# Altium project TIDA-010954-RevB.PrjPcb (part 3 of 6)

## Sheet TIDA-010954-Cycloconverter.SchDoc
size 431 x 279 mm; Date: Not shown in title block; ApprovedBy: Not shown in title block; CheckedBy: Not shown in title block; Author: Not shown in title block; CompanyName: Not shown in title block; Engineer: Not shown in title block; Organization: Not shown in title block; Address1: Not shown in title block; Address2: Not shown in title block; Address3: Not shown in title block; Address4: Not shown in title block; DocumentNumber: 2; Revision: Use project parameter SCH_Rev; SheetNumber: 2; SheetTotal: 9; PageSetup: Record=PageOptions|CenterHorizontal=True|CenterVertical=True|PrintScale=1.00|XCorrection=1.00|YCorrection=1.00|PrintKind=0|BorderSize=5000000|LeftOffset=0|BottomOffset=0|Orientation=2|PaperLength=1000|PaperWidth=1000|Scale=100|PaperSource=15|PrintQuality=600|MediaType=1|DitherType=10|PaperKind=Letter|PrintScaleMode=1; CurrentTime: Not shown in title block; CurrentDate: Not shown in title block; Time: Not shown in title block; DocumentFullPathAndName: Not shown in title block; DocumentName: Not shown in title block; ModifiedDate: 1/25/2022; ImagePath: Not shown in title block
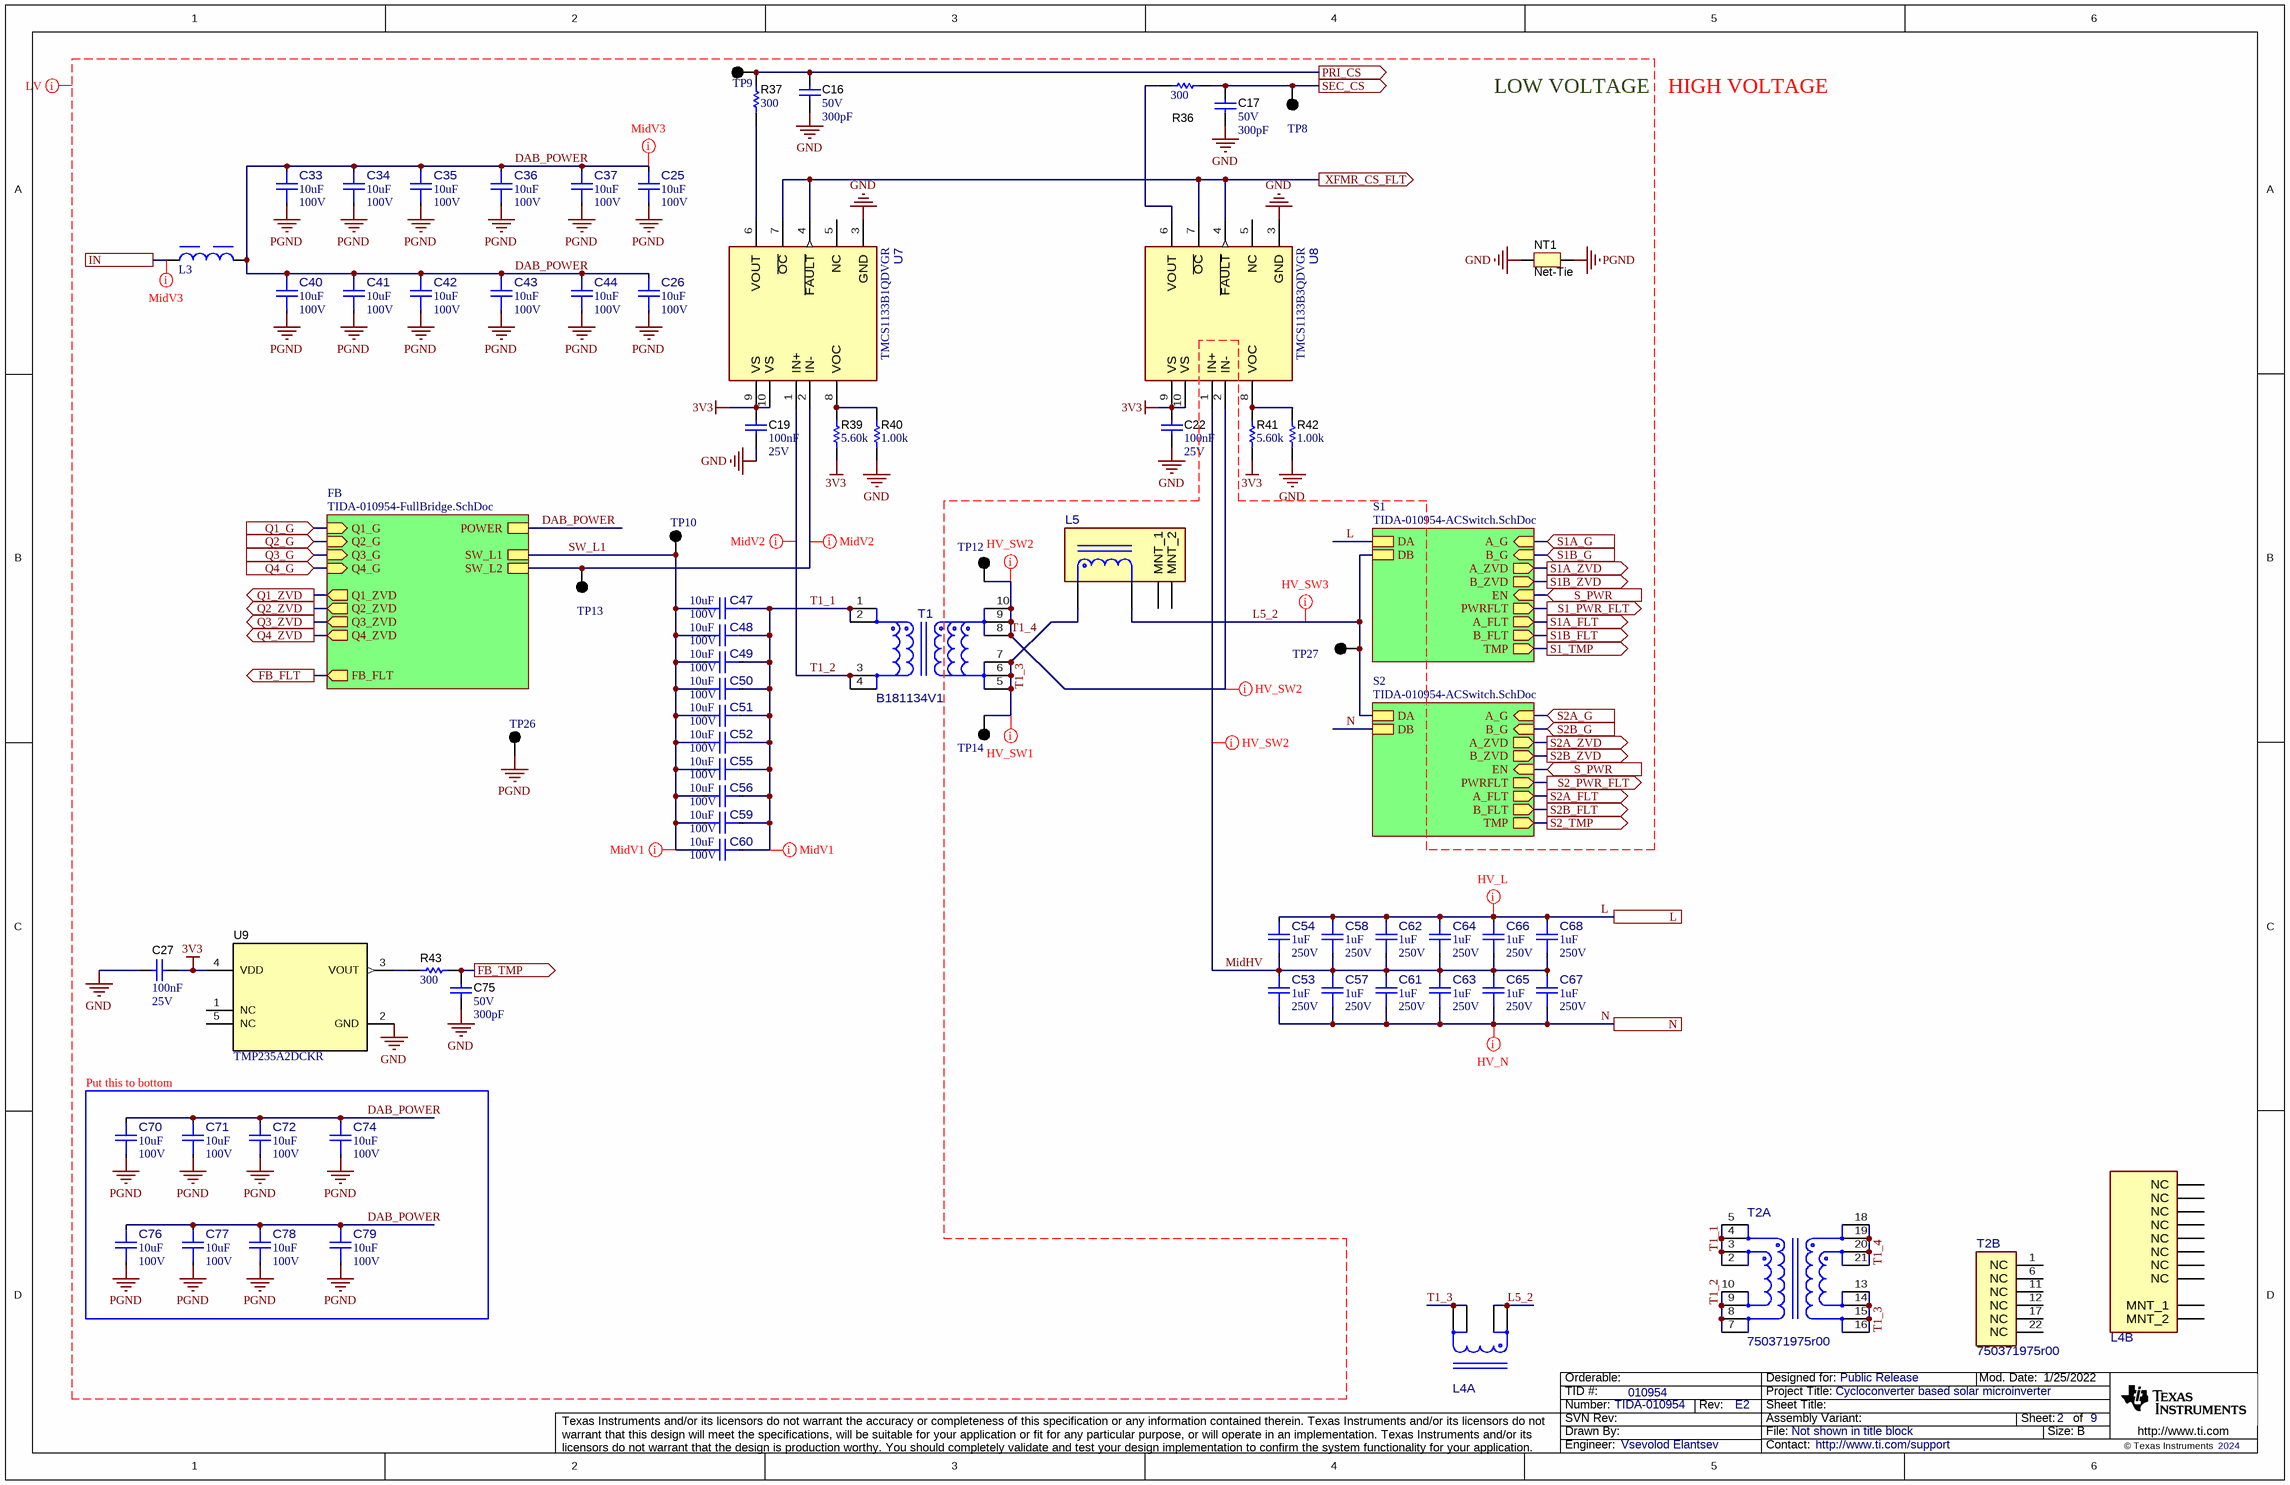
[diagram p4: TIDA-010954-Cycloconverter.SchDoc]

### Parts
C16  VDC_V: 50V  ValueDisplayed: 300pF  [0603]  (hidden comment: GRM1885C1H301JA01D)
C17  VDC_V: 50V  ValueDisplayed: 300pF  [0603]  (hidden comment: GRM1885C1H301JA01D)
C19  Cap_F: 100nF  VDC_V: 25V  [0603]  (hidden comment: CGA3E2X7R1E104K080AA)
C22  Cap_F: 100nF  VDC_V: 25V  [0603]  (hidden comment: CGA3E2X7R1E104K080AA)
C25  ValueDisplayed: 10uF  VDC_V: 100V  [FP-GRM32EC72A106KE05L_1210-MFG]  (hidden comment: GRM32EC72A106KE05L)
C26  ValueDisplayed: 10uF  VDC_V: 100V  [FP-GRM32EC72A106KE05L_1210-MFG]  (hidden comment: GRM32EC72A106KE05L)
C27  Cap_F: 100nF  VDC_V: 25V  [0603]  (hidden comment: CGA3E2X7R1E104K080AA)
C33  ValueDisplayed: 10uF  VDC_V: 100V  [FP-GRM32EC72A106KE05L_1210-MFG]  (hidden comment: GRM32EC72A106KE05L)
C34  ValueDisplayed: 10uF  VDC_V: 100V  [FP-GRM32EC72A106KE05L_1210-MFG]  (hidden comment: GRM32EC72A106KE05L)
C35  ValueDisplayed: 10uF  VDC_V: 100V  [FP-GRM32EC72A106KE05L_1210-MFG]  (hidden comment: GRM32EC72A106KE05L)
C36  ValueDisplayed: 10uF  VDC_V: 100V  [FP-GRM32EC72A106KE05L_1210-MFG]  (hidden comment: GRM32EC72A106KE05L)
C37  ValueDisplayed: 10uF  VDC_V: 100V  [FP-GRM32EC72A106KE05L_1210-MFG]  (hidden comment: GRM32EC72A106KE05L)
C40  ValueDisplayed: 10uF  VDC_V: 100V  [FP-GRM32EC72A106KE05L_1210-MFG]  (hidden comment: GRM32EC72A106KE05L)
C41  ValueDisplayed: 10uF  VDC_V: 100V  [FP-GRM32EC72A106KE05L_1210-MFG]  (hidden comment: GRM32EC72A106KE05L)
C42  ValueDisplayed: 10uF  VDC_V: 100V  [FP-GRM32EC72A106KE05L_1210-MFG]  (hidden comment: GRM32EC72A106KE05L)
C43  ValueDisplayed: 10uF  VDC_V: 100V  [FP-GRM32EC72A106KE05L_1210-MFG]  (hidden comment: GRM32EC72A106KE05L)
C44  ValueDisplayed: 10uF  VDC_V: 100V  [FP-GRM32EC72A106KE05L_1210-MFG]  (hidden comment: GRM32EC72A106KE05L)
C47  ValueDisplayed: 10uF  VDC_V: 100V  [FP-GRM32EC72A106KE05L_1210-MFG]  (hidden comment: GRM32EC72A106KE05L)
C48  ValueDisplayed: 10uF  VDC_V: 100V  [FP-GRM32EC72A106KE05L_1210-MFG]  (hidden comment: GRM32EC72A106KE05L)
C49  ValueDisplayed: 10uF  VDC_V: 100V  [FP-GRM32EC72A106KE05L_1210-MFG]  (hidden comment: GRM32EC72A106KE05L)
C50  ValueDisplayed: 10uF  VDC_V: 100V  [FP-GRM32EC72A106KE05L_1210-MFG]  (hidden comment: GRM32EC72A106KE05L)
C51  ValueDisplayed: 10uF  VDC_V: 100V  [FP-GRM32EC72A106KE05L_1210-MFG]  (hidden comment: GRM32EC72A106KE05L)
C52  ValueDisplayed: 10uF  VDC_V: 100V  [FP-GRM32EC72A106KE05L_1210-MFG]  (hidden comment: GRM32EC72A106KE05L)
C53  ValueDisplayed: 1uF  VDC_V: 250V  [FP-C4532X7T2E105K250KA_1812-MFG]  (hidden comment: C4532X7T2E105K250KA)
C54  ValueDisplayed: 1uF  VDC_V: 250V  [FP-C4532X7T2E105K250KA_1812-MFG]  (hidden comment: C4532X7T2E105K250KA)
C55  ValueDisplayed: 10uF  VDC_V: 100V  [FP-GRM32EC72A106KE05L_1210-MFG]  (hidden comment: GRM32EC72A106KE05L)
C56  ValueDisplayed: 10uF  VDC_V: 100V  [FP-GRM32EC72A106KE05L_1210-MFG]  (hidden comment: GRM32EC72A106KE05L)
C57  ValueDisplayed: 1uF  VDC_V: 250V  [FP-C4532X7T2E105K250KA_1812-MFG]  (hidden comment: C4532X7T2E105K250KA)
C58  ValueDisplayed: 1uF  VDC_V: 250V  [FP-C4532X7T2E105K250KA_1812-MFG]  (hidden comment: C4532X7T2E105K250KA)
C59  ValueDisplayed: 10uF  VDC_V: 100V  [FP-GRM32EC72A106KE05L_1210-MFG]  (hidden comment: GRM32EC72A106KE05L)
C60  ValueDisplayed: 10uF  VDC_V: 100V  [FP-GRM32EC72A106KE05L_1210-MFG]  (hidden comment: GRM32EC72A106KE05L)
C61  ValueDisplayed: 1uF  VDC_V: 250V  [FP-C4532X7T2E105K250KA_1812-MFG]  (hidden comment: C4532X7T2E105K250KA)
C62  ValueDisplayed: 1uF  VDC_V: 250V  [FP-C4532X7T2E105K250KA_1812-MFG]  (hidden comment: C4532X7T2E105K250KA)
C63  ValueDisplayed: 1uF  VDC_V: 250V  [FP-C4532X7T2E105K250KA_1812-MFG]  (hidden comment: C4532X7T2E105K250KA)
C64  ValueDisplayed: 1uF  VDC_V: 250V  [FP-C4532X7T2E105K250KA_1812-MFG]  (hidden comment: C4532X7T2E105K250KA)
C65  ValueDisplayed: 1uF  VDC_V: 250V  [FP-C4532X7T2E105K250KA_1812-MFG]  (hidden comment: C4532X7T2E105K250KA)
C66  ValueDisplayed: 1uF  VDC_V: 250V  [FP-C4532X7T2E105K250KA_1812-MFG]  (hidden comment: C4532X7T2E105K250KA)
C67  ValueDisplayed: 1uF  VDC_V: 250V  [FP-C4532X7T2E105K250KA_1812-MFG]  (hidden comment: C4532X7T2E105K250KA)
C68  ValueDisplayed: 1uF  VDC_V: 250V  [FP-C4532X7T2E105K250KA_1812-MFG]  (hidden comment: C4532X7T2E105K250KA)
C70  ValueDisplayed: 10uF  VDC_V: 100V  [FP-GRM32EC72A106KE05L_1210-MFG]  (hidden comment: GRM32EC72A106KE05L)
C71  ValueDisplayed: 10uF  VDC_V: 100V  [FP-GRM32EC72A106KE05L_1210-MFG]  (hidden comment: GRM32EC72A106KE05L)
C72  ValueDisplayed: 10uF  VDC_V: 100V  [FP-GRM32EC72A106KE05L_1210-MFG]  (hidden comment: GRM32EC72A106KE05L)
C74  ValueDisplayed: 10uF  VDC_V: 100V  [FP-GRM32EC72A106KE05L_1210-MFG]  (hidden comment: GRM32EC72A106KE05L)
C75  VDC_V: 50V  ValueDisplayed: 300pF  [0603]  (hidden comment: GRM1885C1H301JA01D)
C76  ValueDisplayed: 10uF  VDC_V: 100V  [FP-GRM32EC72A106KE05L_1210-MFG]  (hidden comment: GRM32EC72A106KE05L)
C77  ValueDisplayed: 10uF  VDC_V: 100V  [FP-GRM32EC72A106KE05L_1210-MFG]  (hidden comment: GRM32EC72A106KE05L)
C78  ValueDisplayed: 10uF  VDC_V: 100V  [FP-GRM32EC72A106KE05L_1210-MFG]  (hidden comment: GRM32EC72A106KE05L)
C79  ValueDisplayed: 10uF  VDC_V: 100V  [FP-GRM32EC72A106KE05L_1210-MFG]  (hidden comment: GRM32EC72A106KE05L)
L3  7443081030  [WE-HCM_1078_L9.4W6.2H7.8]  (value not drawn)
L4  750371976r00  [FP-750371976r00_XFRMR_22MM0_22MM0-MFG]  (value not drawn)  (parts A,B of 2)
L5  B181125V0  [FP-B181125V0_PTH_IND_41MM45_35MM1-MFG]  (value not drawn)
NT1  Net-Tie  [Net-Tie_50milWide_30milLong]  (net tie, no BOM)
R36  ValueDisplayed: 300  [0603]  (hidden comment: RC0603FR-07300RL)
R37  ValueDisplayed: 300  [0603]  (hidden comment: RC0603FR-07300RL)
R39  ValueDisplayed: 5.60k  [0603]  (hidden comment: RC0603FR-075K6L)
R40  ValueDisplayed: 1.00k  [0603]  (hidden comment: RC0603FR-071KL)
R41  ValueDisplayed: 5.60k  [0603]  (hidden comment: RC0603FR-075K6L)
R42  ValueDisplayed: 1.00k  [0603]  (hidden comment: RC0603FR-071KL)
R43  ValueDisplayed: 300  [0603]  (hidden comment: RC0603FR-07300RL)
T1  B181134V1  [FP-B181134V1_PTH_XFRMR_48MM0_50MM0-MFG]
T2  750371975r00  [FP-750371975r00_PTH_XFRMR_62MM7_62MM8-MFG]  (parts A,B of 2)
TP8  5011  [Keystone5011]  (value not drawn)
TP9  5011  [Keystone5011]  (value not drawn)
TP10  5011  [Keystone5011]  (value not drawn)
TP12  5011  [Keystone5011]  (value not drawn)
TP13  5011  [Keystone5011]  (value not drawn)
TP14  5011  [Keystone5011]  (value not drawn)
TP26  5011  [Keystone5011]  (value not drawn)
TP27  5011  [Keystone5011]  (value not drawn)
U7  TMCS1133B1QDVGR  [DVG0010A-MFG]
U8  TMCS1133B3QDVGR  [DVG0010A-MFG]
U9  PartNumber: TMP235A2DCKR  [DCK0005A_N]  (hidden comment: TMP235DCK)

### Blocks framed on the sheet
Put this to bottom: C70-C72 C74 C76-C79

### Sub-sheets
FB = TIDA-010954-FullBridge.SchDoc: Q1_G (in), Q2_G (in), FB_FLT (out), Q2_ZVD (out), Q1_ZVD (out), Q3_G (in), Q4_G (in), Q4_ZVD (out), Q3_ZVD (out), SW_L1, SW_L2, POWER
S1 = TIDA-010954-ACSwitch.SchDoc: A_G (in), B_G (in), A_ZVD (out), B_ZVD (out), A_FLT (out), B_FLT (out), EN (in), PWRFLT (out), DA, DB, TMP (out)
S2 = TIDA-010954-ACSwitch.SchDoc: A_G (in), B_G (in), A_ZVD (out), B_ZVD (out), A_FLT (out), B_FLT (out), EN (in), PWRFLT (out), DA, DB, TMP (out)

### Ports
FB_FLT (out), FB_TMP (out), IN, L, N, PRI_CS (out), Q1_G (in), Q1_ZVD (out), Q2_G (in), Q2_ZVD (out), Q3_G (in), Q3_ZVD (out), Q4_G (in), Q4_ZVD (out), S1_PWR_FLT (out), S1_TMP (out), S1A_FLT (out), S1A_G (in), S1A_ZVD (out), S1B_FLT (out), S1B_G (in), S1B_ZVD (out), S2_PWR_FLT (out), S2_TMP (out), S2A_FLT (out), S2A_G (in), S2A_ZVD (out), S2B_FLT (out), S2B_G (in), S2B_ZVD (out), S_PWR (in), SEC_CS (out), XFMR_CS_FLT (out)

### Nets
3V3: C19.1 C22.1 C27.1 R39.1 R41.1 U7.9(VS) U7.10(VS) U8.9(VS) U8.10(VS) U9.4(VDD)
GND: C16.2 C17.2 C19.2 C22.2 C27.2 C75.2 NT1.1 R40.1 R42.1 U7.3(GND) U8.3(GND) U9.2(GND)
PGND: C25.1 C26.1 C33.1 C34.1 C35.1 C36.1 C37.1 C40.1 C41.1 C42.1 C43.1 C44.1 C70.1 C71.1 C72.1 C74.1 C76.1 C77.1 C78.1 C79.1 NT1.2 TP26.1
DAB_POWER: C25.2 C26.2 C33.2 C34.2 C35.2 C36.2 C37.2 C40.2 C41.2 C42.2 C43.2 C44.2 C70.2 C71.2 C72.2 C74.2 C76.2 C77.2 C78.2 C79.2 L3.2 ; sheet FB/POWER
~{FAULT}: port FB_FLT, sheet FB/FB_FLT
FB_TMP: C75.1 R43.1 ; port FB_TMP
L: C54.2 C58.2 C62.2 C64.2 C66.2 C68.2 ; port L, sheet S1/DA  [project net DA]
L5_2: L4.1 L4.2 L5.2 TP27.1 ; sheet S1/DB, sheet S2/DA  [project net DA]
MidHV: C53.2 C54.1 C57.2 C58.1 C61.2 C62.1 C63.2 C64.1 C65.2 C66.1 C67.2 C68.1 U8.1(IN+)
N: C53.1 C57.1 C61.1 C63.1 C65.1 C67.1 ; port N, sheet S2/DB  [project net DB]
PRI_CS: C16.1 R37.2 TP9.1 ; port PRI_CS
PVIN: L3.1 ; port IN
Q1_G: port Q1_G, sheet FB/Q1_G
Q1_ZVD: port Q1_ZVD, sheet FB/Q1_ZVD
Q2_G: port Q2_G, sheet FB/Q2_G
Q2_ZVD: port Q2_ZVD, sheet FB/Q2_ZVD
Q3_G: port Q3_G, sheet FB/Q3_G
Q3_ZVD: port Q3_ZVD, sheet FB/Q3_ZVD
Q4_G: port Q4_G, sheet FB/Q4_G
Q4_ZVD: port Q4_ZVD, sheet FB/Q4_ZVD
S1_PWR_FLT: port S1_PWR_FLT, sheet S1/PWRFLT
S1_TMP: port S1_TMP, sheet S1/TMP
S1A_FLT: port S1A_FLT, sheet S1/A_FLT
S1A_G: port S1A_G, sheet S1/A_G
S1A_ZVD: port S1A_ZVD, sheet S1/A_ZVD
S1B_FLT: port S1B_FLT, sheet S1/B_FLT
S1B_G: port S1B_G, sheet S1/B_G
S1B_ZVD: port S1B_ZVD, sheet S1/B_ZVD
S2_PWR_FLT: port S2_PWR_FLT, sheet S2/PWRFLT
S2_TMP: port S2_TMP, sheet S2/TMP
S2A_FLT: port S2A_FLT, sheet S2/A_FLT
S2A_G: port S2A_G, sheet S2/A_G
S2A_ZVD: port S2A_ZVD, sheet S2/A_ZVD
S2B_FLT: port S2B_FLT, sheet S2/B_FLT
S2B_G: port S2B_G, sheet S2/B_G
S2B_ZVD: port S2B_ZVD, sheet S2/B_ZVD
S_PWR: port S_PWR, sheet S1/EN, sheet S2/EN
SEC_CS: C17.1 R36.2 TP8.1 ; port SEC_CS
SW_L1: C47.2 C48.2 C49.2 C50.2 C51.2 C52.2 C55.2 C56.2 C59.2 C60.2 TP10.1 ; sheet FB/SW_L1
SW_L2: TP13.1 U7.2(IN-) ; sheet FB/SW_L2
T1_1: C47.1 C48.1 C49.1 C50.1 C51.1 C52.1 C55.1 C56.1 C59.1 C60.1 T1.1 T1.2 T2.2 T2.3 T2.4 T2.5
T1_2: T1.3 T1.4 T2.7 T2.8 T2.9 T2.10 U7.1(IN+)
T1_3: L4.7 L4.8 L5.1 T1.5 T1.6 T1.7 T2.13 T2.14 T2.15 T2.16 TP14.1
T1_4: T1.8 T1.9 T1.10 T2.18 T2.19 T2.20 T2.21 TP12.1 U8.2(IN-)
XFMR_CS_FLT: U7.4(~{FAULT}) U7.7(~{OC}) U8.4(~{FAULT}) U8.7(~{OC}) ; port XFMR_CS_FLT
NetR36_1: R36.1 U8.6(VOUT)
NetR37_1: R37.1 U7.6(VOUT)
NetR39_2: R39.2 R40.2 U7.8(VOC)
NetR41_2: R41.2 R42.2 U8.8(VOC)
NetR43_2: R43.2 U9.3(VOUT)

Not connected (* = marked no-connect by the designer): L4 3(NC) 4(NC) 5(NC) 6(NC) 9(NC) 10(NC) 11(NC) 12(NC) 13(MNT_1) 14(MNT_2); L5 3(MNT_1) 4(MNT_2); T2 1(NC) 6(NC) 11(NC) 12(NC) 17(NC) 22(NC); U7 5(NC); U8 5(NC); U9 1(NC) 5(NC)

### Layout directives
net class HV_SW1: T1_3
net class HV_SW2: MidHV, T1_4
net class HV_L: DA
net class HV_SW3: DA
net class HV_N: DB
net class MidV3: DAB_POWER, PVIN
net class LV: 3V3, DAB_POWER, GND, PGND, SW_L1, T1_1, T1_2
net class MidV2: SW_L2, T1_2
net class MidV1: SW_L1, T1_1

### Notes on the sheet
- LOW VOLTAGE
- HIGH VOLTAGE
- Drawn By:
- SVN Rev:
- Number:
- TID #:
- Orderable:
- Rev:
- Sheet Title:
- File:
- Project Title:
- Designed for:
- Assembly Variant:
- Mod. Date:
- Sheet:
- Size:
- of
- B
- http://www.ti.com
- Texas Instruments and/or its licensors do not warrant the accuracy or completeness of this specification or any information contained therein. Texas Instruments and/or its licensors do not warrant that this design will meet the specifications, will be suitable for your application or fit for any particular purpose, or will operate in an implementation. Texas Instruments and/or its licensors do not warrant that the design is production worthy. You should completely validate and test your design implementation to confirm the system functionality for your application.
- Engineer:
- Contact:
- © Texas Instruments

### Library data of the parts
C16 C17 C75 = CMP-0007206-4: CAP, CERM, 300 pF, 50 V, +/- 5%, C0G/NP0, 0603; Manufacturer: MuRata; TaMin_C: -55°C; Polarized: N; SizeAreaWB_mm2: 4.68; Value1: Unknown; U/M: EA; Value: 300pF; TaMax_C: 125°C; SizeZ_mm: 1; SizeX_mm: 1.6; SizeY_mm: 0.8; SizeArea_mm2: 1.28; AEC Category: Q200; Supplier Part Number 2: 81-GRM185C1H301JA01D; Publisher: Texas Instruments; Supplier 2: Mouser; TempCo: C0G/NP0; Published: 2008-06-19; RoHS: Y; MountType: SMT; Supplier 1: Digi-Key; PackageReference: 0603; Tolerance_%: 5%; Cap_Case: 0603; Value2: 50V; CompType: Capacitor; LatestRevisionDate: 2017-03-09; PartNumber: GRM1885C1H301JA01D; AEC Qualified: ?; Cap_F: 300pF; ComponentLink1Description: Datasheet link; Supplier Part Number 1: 490-1438-1-ND; Technology: Ceramic; ComponentLink1URL: http://search.murata.co.jp/Ceramy/PnsearchViewAction.do?HnOFG=ON&HnNFG=ON&SEL_CNT=50&sLang=en&sKey=GRM1885C1H301JA01D&x=9&y=9&search=startwith
C19 C22 C27 = CMP-0007077-5: CAP, CERM, 0.1 uF, 25 V, +/- 10%, X7R, AEC-Q200 Grade 1, 0603; Manufacturer: TDK; TaMin_C: -55°C; Polarized: N; SizeAreaWB_mm2: 4.68; Value1: Unknown; U/M: EA; Value: 0.1uF; TaMax_C: 125°C; SizeZ_mm: 1; SizeX_mm: 1.6; SizeY_mm: 0.8; SizeArea_mm2: 1.28; AEC Qualified: Y; AEC Category: Q200; Supplier Part Number 2: 79Y4100; Publisher: Texas Instruments; Supplier 2: Newark; Supplier Part Number 3: 810-CGA3E2X7R1E104K; TempCo: X7R; Supplier 3: Mouser; Published: 2008-06-19; RoHS: Y; MountType: SMT; Supplier 1: Digi-Key; PackageReference: 0603; Tolerance_%: 10%; Cap_Case: 0603; Value2: 25V; CompType: Capacitor; LatestRevisionDate: 2017-03-09; PartNumber: CGA3E2X7R1E104K080AA; ComponentLink1Description: Datasheet link; AEC Grade: 1; Supplier Part Number 1: 445-5667-1-ND; Technology: Ceramic; ValueDisplayed: 0.1uF; ComponentLink1URL: https://product.tdk.com/info/en/documents/chara_sheet/CGA3E2X7R1E104K080AA.pdf
C25 C26 C33-C37 C40-C44 C47-C52 C55 C56 C59 C60 C70-C72 C74 C76-C79 = CMP-0087970-1: 10µF ±10% 100V Ceramic Capacitor X7S 1210 (3225 Metric); Manufacturer: Murata; Symbol Name: SYM-GRM32EC72A106KE05L; Tolerance_%: 0.1; AEC Qualified: No; TempCo: 22%; SizeZ_mm: 2.7mm; RoHS: TRUE; ComponentLink1Description: Datasheet; ComponentLink1URL: https://search.murata.co.jp/Ceramy/image/img/A01X/G101/ENG/GRM32EC72A106KE05-01A.pdf; PackageReference: 1210; PartNumber: GRM32EC72A106KE05L; Cap_F: 10µF
C53 C54 C57 C58 C61-C68 = CMP-0091547-1: Multilayer Ceramic Capacitors 1uF ±10% 250V X7T SMD 1812; Manufacturer: TDK; Cap_F: 1µF; Tolerance_%: 0.1%; TempCo: +22/-33%; Value: 1µF; SizeZ_mm: 2.8mm; AEC Qualified: No; Part Number: C4532X7T2E105K250KA; helpURL: https://upverter.com/upn/revision/c5b3fd182a76e9cb/; Datasheet Path: datasheets/Cap-C4532X7T2E105K250KA.pdf; ComponentLink1Description: Datasheet; Lead Free: Yes; datasheet: https://product.tdk.com/en/search/capacitor/ceramic/mlcc/info?part_no=C4532X7T2E105K250KA; PartNumber: C4532X7T2E105K250KA; RoHS: TRUE; ComponentLink1URL: https://product.tdk.com/en/search/capacitor/ceramic/mlcc/info?part_no=C4532X7T2E105K250KA; Temperature Characteristic: X7T; PackageReference: 1812; Operating Temperature Range: -55°C to +125°C
L3 = CMP-0098580-1: WE-HCM SMT High Current Flat Wire Inductor, size 1078, 0.14uH, 38A, 0.29mOhm; Manufacturer: Wurth Elektronik; Material: MnZn; Case/Size Code: 1078; Inductance: 0.3uH; Saturation Current: 34.6A; Self Resonant Frequency: 33MHz; Design Item ID: 7443081030; Category: Power Inductors; Component Type: Standard; DC Resistance: 0.29mOhm; Height: 7.8mm; Length: 9.4mm; Manufacturer Part Number: 7443081030; Match Code: WE-HCM; Mount: Surface Mount; Operating Temperature Max: 125°C; Operating Temperature Min: -40°C; Packaging: Tape and Reel; Pin Count: 2; Rated Current: 38A; Rated Inductance: 0.14uH; Source: Inductors.SchLib; Width: 6.2mm; ComponentLink1Description: Website Link; ComponentLink1URL: https://www.we-online.com/redexpert/article/7443081030?ad; ComponentLink2Description: Datasheet Link; ComponentLink2URL: https://www.we-online.com/redexpert/spec/7443081030?ad; PartNumber: 7443081030
L4 = CMP-0123014-1: Inductor, 3 uH, 3mOhm; Manufacturer: Wurth Electronics; AEC Qualified: No; DCR_ohm: 3m; Ind_H: 3µH; SizeZ_mm: 17.27mm; Value: 3uH; Test Frequency: 10kHz; Tolerance_%: 10%; PackageReference: XFRMR_22MM0_22MM0; PartNumber: 750371976r00; RoHS: TRUE; Technology: Wirewound; Part Number: 750371976r00; Datasheet Path: datasheets/Ind-750371976r00.pdf; helpURL: https://upverter.com/upn/revision/9174a4345abaf52b/; Lead Free: Yes; Operating Temperature Range: -40°C to +125°C
L5 = CMP-0123108-1: Inductor 5uH; Manufacturer: Bourns; AEC Qualified: No; DCR_ohm: 3.6m; Ind_H: 5µH; Isat: 20A; SizeZ_mm: 16.75mm; Test Frequency: 100kHz; Tolerance_%: 10%; PackageReference: PTH_IND_41MM45_35MM1; PartNumber: B181125V0; RoHS: TRUE; Technology: Wirewound; Value: 5uH; Part Number: B181125V0; Datasheet Path: datasheets/Ind-B181125V0.pdf; helpURL: https://upverter.com/upn/revision/4e8e535f5f00be80/; Lead Free: Yes; Operating Temperature Range: -40°C to +125°C
NT1 = CMP-0078142-6: Single point connection between nets.; Library Reference: Net-Tie; Manufacturer: N/A; CompType: Net-Tie; PartNumber: N/A; MountType: SMT; PackageReference: N/A
R36 R37 R43 = CMP-0023013-5: RES, 300, 1%, 0.1 W, 0603; Manufacturer: Yageo; Power_W: 100mW; TempCo: 100 ppm/C; Value_Code: 300R; Value: 300; SizeX_mm: 1.6; SizeY_mm: 0.8; SizeZ_mm: 1; Value2: 0.1W; SizeArea_mm2: 1.28; AEC Qualified: N; VDC_V: 75V; AEC Category: Q200; SizeAreaWB_mm2: 4.68; Supplier Part Number 2: 603-RC0603FR-07300RL; Supplier 2: Mouser; Supplier Part Number 3: 1799340; Supplier 3: Farnell; RoHS: Y; Value1: 1%; MountType: SMT; Supplier 1: Digi-Key; PackageReference: 0603; Tolerance_%: 1%; Res_ohm: 300; CompType: Resistor; PartNumber: RC0603FR-07300RL; ComponentLink1Description: Datasheet link; Supplier Part Number 1: 311-300HRCT-ND; Technology: Thick Film; ComponentLink1URL: http://www.yageo.com/pdf/Pu-RC0603_51_PbFree_L_2.pdf; AEC Grade: N/A
R39 R41 = CMP-0023203-5: RES, 5.60 k, 1%, 0.1 W, 0603; Manufacturer: Yageo; Power_W: 100mW; TempCo: 100 ppm/C; Value_Code: 5k60; Value: 5.60k; Res_ohm: 5.6k; SizeX_mm: 1.6; SizeY_mm: 0.8; SizeZ_mm: 1; Value2: 0.1W; SizeArea_mm2: 1.28; AEC Qualified: N; VDC_V: 75V; AEC Category: Q200; SizeAreaWB_mm2: 4.68; Supplier Part Number 2: 603-RC0603FR-075K6L; Supplier 2: Mouser; Supplier Part Number 3: 9238573; Supplier 3: Farnell; RoHS: Y; Value1: 1%; MountType: SMT; Supplier 1: Digi-Key; PackageReference: 0603; Tolerance_%: 1%; CompType: Resistor; PartNumber: RC0603FR-075K6L; ComponentLink1Description: Datasheet link; Supplier Part Number 1: 311-5.60KHRCT-ND; Technology: Thick Film; ComponentLink1URL: http://www.yageo.com/pdf/Pu-RC0603_51_PbFree_L_2.pdf; AEC Grade: N/A
R40 R42 = CMP-0022895-5: RES, 1.00 k, 1%, 0.1 W, 0603; Manufacturer: Yageo; Power_W: 100mW; TempCo: 100 ppm/C; Value_Code: 1k00; Value: 1.00k; EIA_Code: E96; Res_ohm: 1k; SizeX_mm: 1.6; SizeY_mm: 0.8; SizeZ_mm: 1; Value2: 0.1W; SizeArea_mm2: 1.28; AEC Qualified: N; VDC_V: 75V; AEC Category: Q200; SizeAreaWB_mm2: 4.68; Supplier Part Number 2: 603-RC0603FR-071KL; Supplier 2: Mouser; Supplier Part Number 3: 9238484; Supplier 3: Farnell; RoHS: Y; Value1: 1%; MountType: SMT; Supplier 1: Digi-Key; PackageReference: 0603; Tolerance_%: 1%; CompType: Resistor; PartNumber: RC0603FR-071KL; ComponentLink1Description: Datasheet link; Supplier Part Number 1: 311-1.00KHRCT-ND; Technology: Thick Film; ComponentLink1URL: http://www.yageo.com/pdf/Pu-RC0603_51_PbFree_L_2.pdf; AEC Grade: N/A
T1 = CMP-0123122-1: Transformer; Manufacturer: Bourns; DCR_ohm: 1.14m; Ind_H: 7.6µH; Ns1toNp: 1:3.5; Rsec1_ohm: 14m; SizeZ_mm: 32mm; AEC Qualified: No; Voltage_Isolation_Vrms: 3kV; PackageReference: PTH_XFRMR_48MM0_50MM0; PartNumber: B181134V1; RoHS: TRUE; Part Number: B181134V1; Datasheet Path: datasheets/Trans-B181134V1.pdf; helpURL: https://upverter.com/upn/revision/e674d582bcaf96ef/; Lead Free: Yes; Operating Temperature Range: -40°C to +125°C
T2 = CMP-0122999-1: TRANSFORMER; Manufacturer: Wurth Electronics; DCR_ohm: 4m; Ind_H: 10µH; Ns1toNp: 1:3.5; Rsec1_ohm: 47m; SizeZ_mm: 46.3mm; AEC Qualified: No; Voltage_Isolation_Vrms: 3.5kV; PackageReference: PTH_XFRMR_62MM7_62MM8; PartNumber: 750371975r00; RoHS: TRUE; Part Number: 750371975r00; Datasheet Path: datasheets/Trans-750371975r00.pdf; helpURL: https://upverter.com/upn/revision/2682f03042b07002/; Lead Free: Yes; Operating Temperature Range: -40°C to +125°C
TP8-TP10 TP12-TP14 TP26 TP27 = CMP-0055148-2: Test Point, Multipurpose, Black, TH; Manufacturer: Keystone Electronics; CNHeader: FALSE; ContactFinish: Silver; Green_REACh: Passed; Green_Lifecycle: Active; CT: TRUE; ComponentLink1Description: Datasheet URL; Supplier 1: Digi-Key; MountType: TH; Supplier 2: Mouser; LatestRevisionDate: 26/05/2017; Publisher: Texas Instruments; PartNumber: 5011; Color: Black; ComponentLink1URL: http://www.keyelco.com/userAssets/file/M60-2p60.pdf; Green_EU RoHS-2: Incomplete; Supplier Part Number 1: 36-5011-ND; Supplier Part Number 2: 534-5011; Green_EU RoHS: Passed; RoHS: Y; PackageReference: Black Multipurpose Testpoint; CompType: Test Point
U7 = CMP-0097984-1: Manufacturer: Texas Instruments; Standoff Height: 0.1mm; SizeZ_mm: 2.65mm; helpURL: https://upverter.com/upn/revision/f7e4ed2791c57507/; Operating Temperature Range: to; RoHS: UNKNOWN; PartNumber: TMCS1133B1QDVGR; Part Number: TMCS1133B1QDVGR; Datasheet Path: datasheets/IC-TMCS1133B1QDVGR.pdf; PackageReference: SOIC10
U8 = CMP-0097986-1: Manufacturer: Texas Instruments; SizeZ_mm: 2.65mm; Standoff Height: 0.1mm; Part Number: TMCS1133B3QDVGR; Datasheet Path: datasheets/IC-TMCS1133B3QDVGR.pdf; RoHS: UNKNOWN; Operating Temperature Range: to; helpURL: https://upverter.com/upn/revision/3a7ff79afd910b2c/; PackageReference: SOIC10; PartNumber: TMCS1133B3QDVGR
U9 = CMP-0013250-3: TMP235DCK, DCK0005A (SOT-5); Manufacturer: Texas Instruments; SizeX_mm: 2.1; SizeY_mm: 2.0; CompType: IC; SizeZ_mm: 1.1; SizeArea_mm2: 4.2; SizeAreaWB_mm2: 9.3; AEC Category: Q200; AEC Qualified: N; PackageDescription: SOT-SC70-5; ComponentLink1URL: https://sps06.itg.ti.com/sites/KMS/crossdivteams/altium/docs/ComponentDatasheets/TMP235 Initial data sheet MCP9700.pdf; ComponentLink1Description: Datasheet Link; PackageReference: DCK0005A; MountType: SMT; ComponentLink2Description: Product Folder; ComponentLink2URL: http://www.ti.com/product/GPN; ComponentLink3Description: Online Datasheet; ComponentLink3URL: http://www.ti.com/product/GPN/datasheet